# EAGLE design flight_computer_board_f1 (EAGLE 9.0.1)
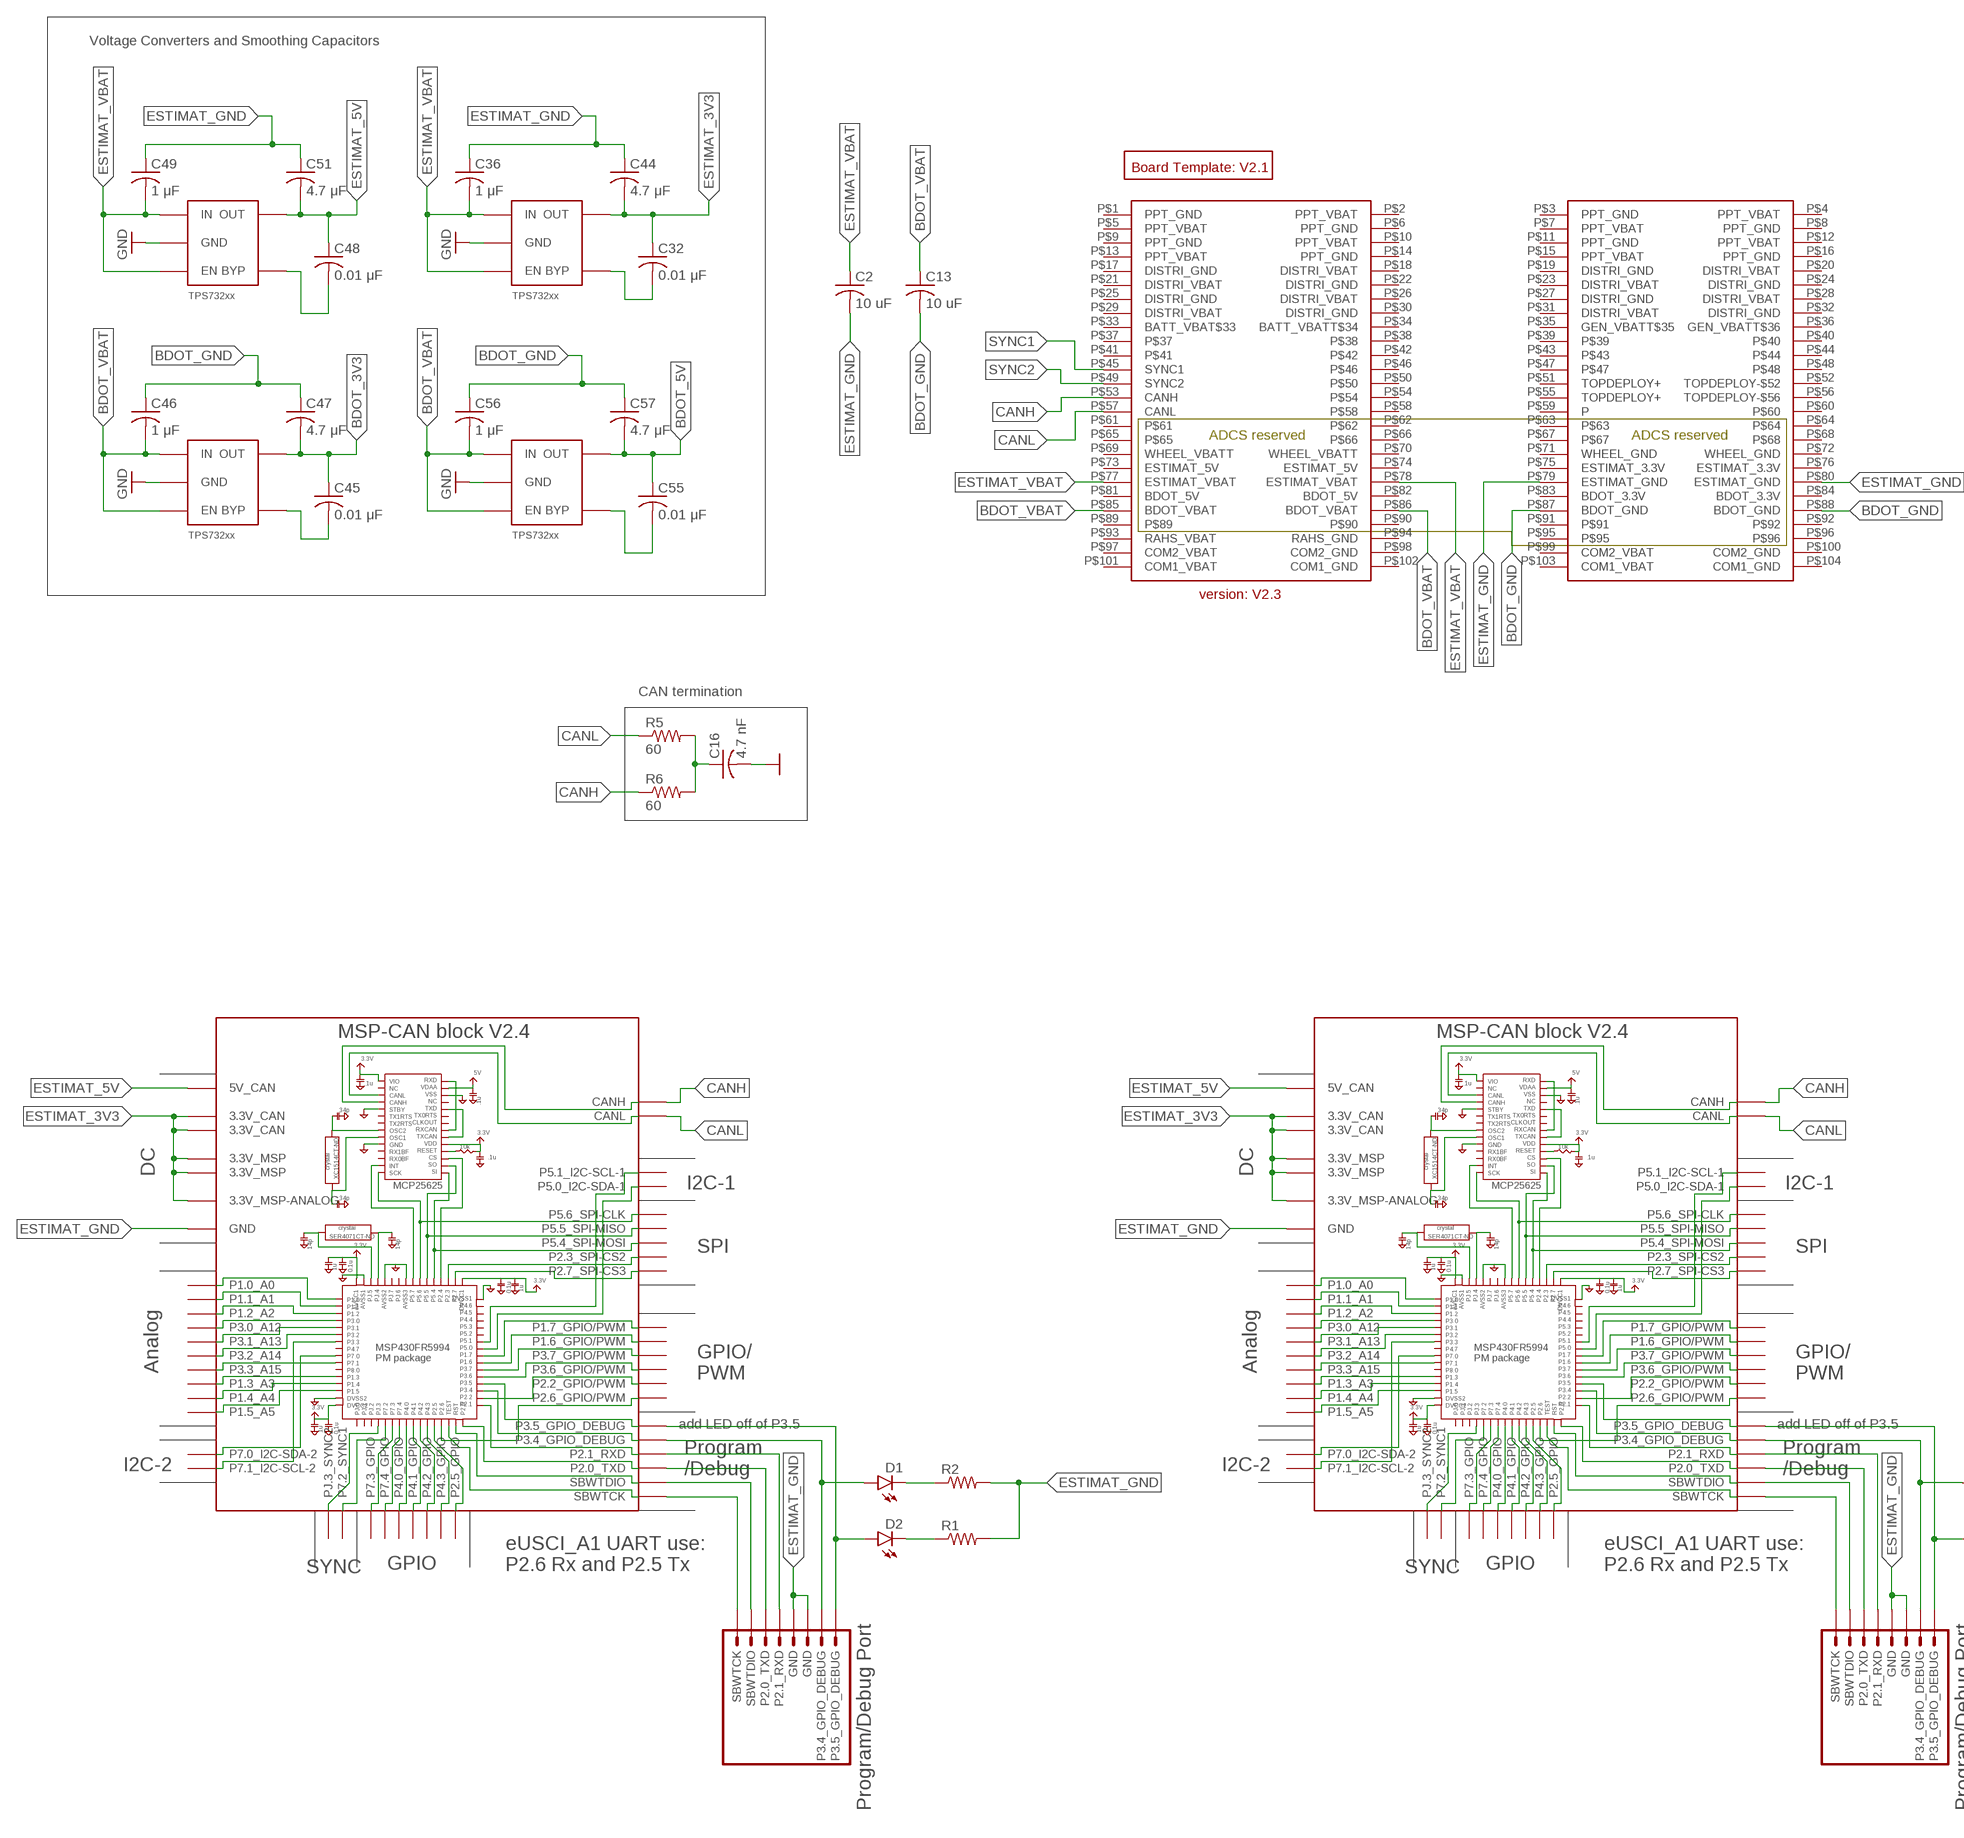
[diagram p0: schematic, sheet 1, part 1 of 2]
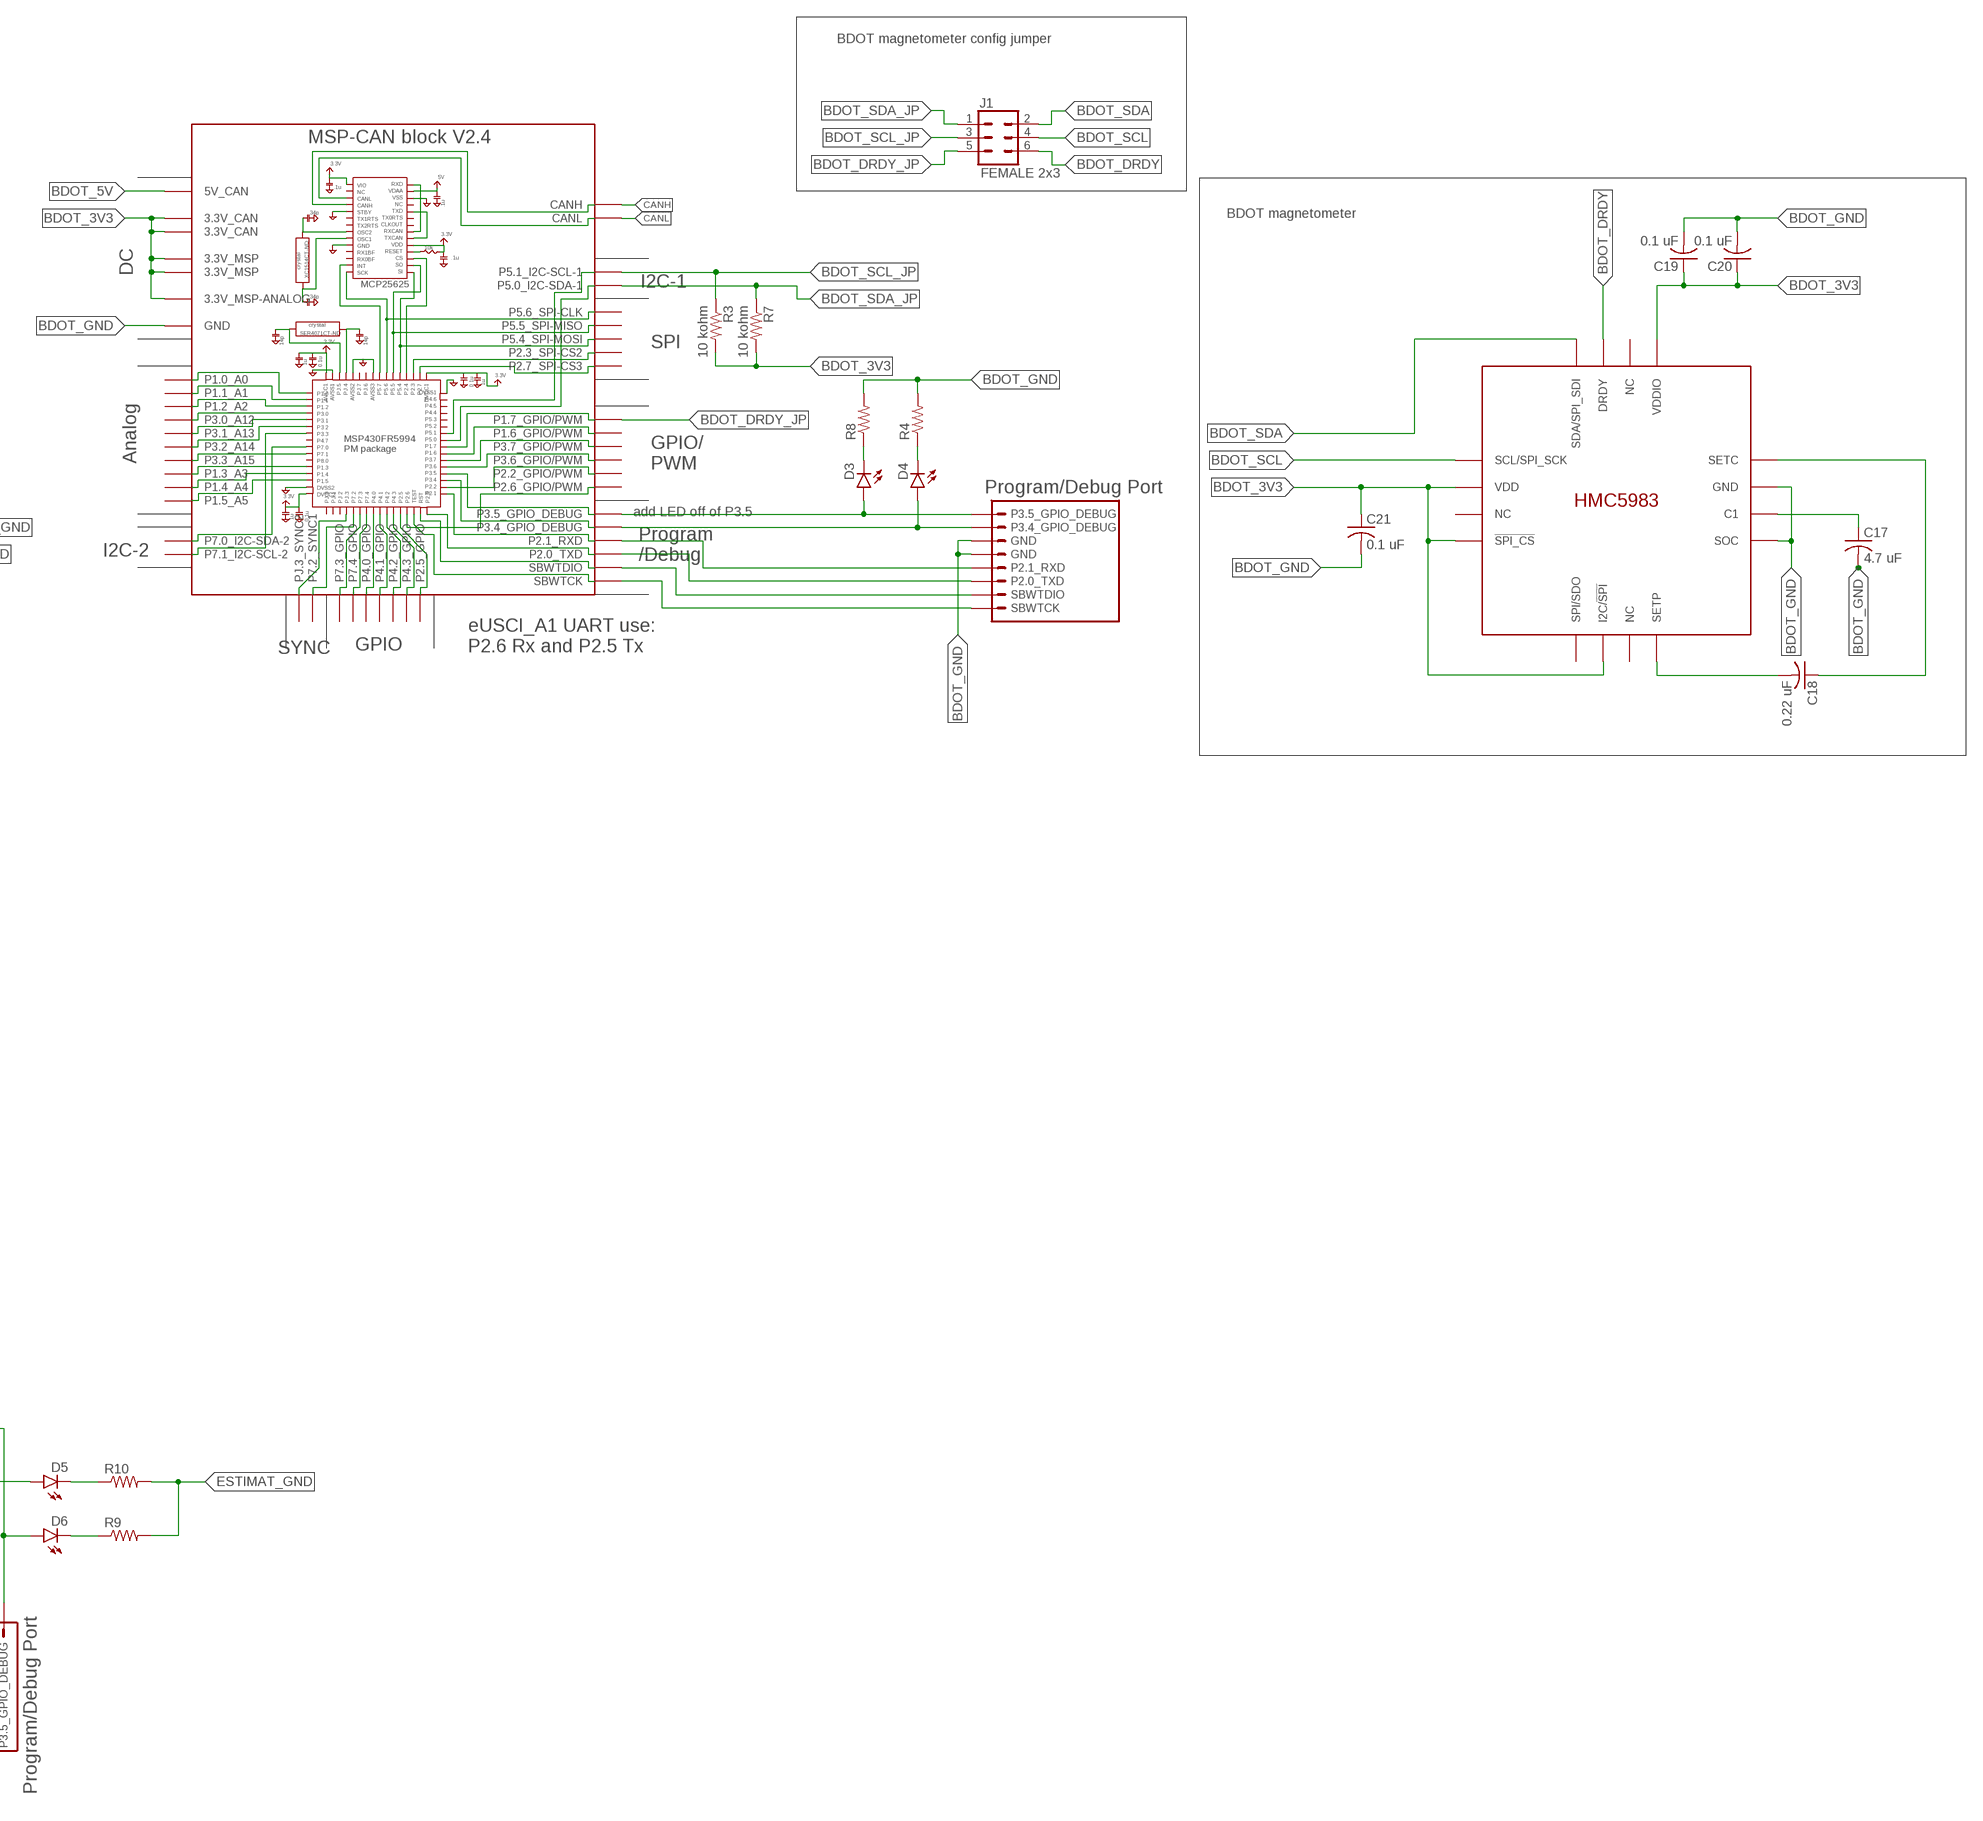
[diagram p1: schematic, sheet 1, part 2 of 2]

## Parts
BLK1  MSP-CAN_BLOCK  [MSP-CAN_BLOCK]
BLK2  MSP-CAN_BLOCK  [MSP-CAN_BLOCK]
C2  10 uF  C-USC0805  [C0805]
C13  10 uF  C-USC0805  [C0805]
C16  4.7 nF  C-USC0805  [C0805]
C17  4.7 uF  C-USC0805  [C0805]
C18  0.22 uF  C-USC0805  [C0805]
C19  0.1 uF  C-USC0805  [C0805]
C20  0.1 uF  C-USC0805  [C0805]
C21  0.1 uF  C-USC0805  [C0805]
C32  0.01 μF  C-USC0805  [C0805]
C36  1 μF  C-USC0805  [C0805]
C44  4.7 μF  C-USC0805  [C0805]
C45  0.01 μF  C-USC0805  [C0805]
C46  1 μF  C-USC0805  [C0805]
C47  4.7 μF  C-USC0805  [C0805]
C48  0.01 μF  C-USC0805  [C0805]
C49  1 μF  C-USC0805  [C0805]
C51  4.7 μF  C-USC0805  [C0805]
C55  0.01 μF  C-USC0805  [C0805]
C56  1 μF  C-USC0805  [C0805]
C57  4.7 μF  C-USC0805  [C0805]
D1  LED  [LED-1206]
D2  LED  [LED-1206]
D3  LED  [LED-1206]
D4  LED  [LED-1206]
D5  LED  [LED-1206]
D6  LED  [LED-1206]
J1  FEMALE 2x3  CONN_03X2FEMALE  [2X3]
R1  RESISTOR0805  [0805]
R2  RESISTOR0805  [0805]
R3  10 kohm  RESISTOR0805  [0805]
R4  RESISTOR0805  [0805]
R5  60  RESISTOR0805-RES  [0805]
R6  60  RESISTOR0805-RES  [0805]
R7  10 kohm  RESISTOR0805  [0805]
R8  RESISTOR0805  [0805]
R9  RESISTOR0805  [0805]
R10  RESISTOR0805  [0805]
U4  TPS732XX  [SOT-23-5]
U5  TPS732XX  [SOT-23-5]
U6  TPS732XX  [SOT-23-5]
U8  TPS732XX  [SOT-23-5]
U$1  PROGRAM/DEBUG_PORT  [1X08_CONNECTOR]
U$2  PROGRAM/DEBUG_PORT  [1X08_CONNECTOR]
U$5  BOARD_TEMPLATE1  [BOARD_TEMPLATE]
U$6  PC104_CONNECTOR  [PC104_CONNECTOR]
U$7  MSP-CAN_BLOCK  [MSP-CAN_BLOCK]
U$14  PROGRAM/DEBUG_PORT  [1X08_CONNECTOR]
U$15  HMC5983  [HMC5983]

## Nets
BDOT_3V3: C19.1 C20.1 C21.1 C45.1 C47.2 R3.2 R7.2 U5.P$5(OUT) U$7.3.3V@CAN1(3.3V_CAN) U$7.3.3V@CAN2(3.3V_CAN) U$7.3.3V@MSP1(3.3V_MSP) U$7.3.3V@MSP2(3.3V_MSP) U$7.3.3V_ANALOG@MSP2(3.3V_MSP-ANALOG) U$15.!SPI_CS U$15.I2C/!SPI U$15.VDD U$15.VDDIO
BDOT_5V: C55.1 C57.2 U8.P$5(OUT) U$7.5V(5V_CAN)
BDOT_DRDY: J1.6 U$15.DRDY
BDOT_DRDY_JP: J1.5 U$7.P1.7_GPIO/PWM
BDOT_GND: C13.2 C17.2 C19.2 C20.2 C21.2 C46.1 C47.1 C56.1 C57.1 R4.2 R8.2 U5.P$2(GND) U8.P$2(GND) U$6.P$87(BDOT_GND) U$6.P$88(BDOT_GND) U$7.GND@1(GND) U$7.GND@2(GND) U$7.GND@3(GND) U$7.GND@4(GND) U$7.GND@5(GND) U$7.GND@7(GND) U$7.GND@8(GND) U$7.GND@9(GND) U$7.GND@10(GND) U$7.GND@11(GND) U$7.GND@12(GND) U$7.GND@13(GND) U$7.GND@14(GND) U$7.GND@15(GND) U$7.GND@16(GND) U$7.GND@17(GND) U$7.GND@26(GND) U$14.5(GND) U$14.6(GND) U$15.GND U$15.SOC ; supply symbol labelled GND
BDOT_LDO_3V3_BYP: C45.2 U5.P$4(BYP)
BDOT_LDO_5V_BYP: C55.2 U8.P$4(BYP)
BDOT_P3.4_GPIO_DEBUG: D4.A U$7.P3.4_GPIO_DEBUG U$14.7(P3.4_GPIO_DEBUG)
BDOT_P3.5_GPIO_DEBUG: D3.A U$7.P3.5_GPIO_DEBUG U$14.8(P3.5_GPIO_DEBUG)
BDOT_RXD: U$7.P2.1_RXD U$14.4(P2.1_RXD)
BDOT_SBWTCK: U$7.SBWTCK U$14.SBWTCK
BDOT_SBWTDIO: U$7.SBWTDIO U$14.2(SBWTDIO)
BDOT_SCL: J1.4 U$15.SCL/SPI_SCK
BDOT_SCL_JP: J1.3 R3.1 U$7.P5.1_I2C-SCL-1
BDOT_SDA: J1.2 U$15.SDA/SPI_SDI
BDOT_SDA_JP: J1.1 R7.1 U$7.P5.0_I2C-SDA-1
BDOT_TXD: U$7.P2.0_TXD U$14.3(P2.0_TXD)
BDOT_VBAT: C13.1 C46.2 C56.2 U5.P$1(IN) U5.P$3(EN) U8.P$1(IN) U8.P$3(EN) U$6.P$85(BDOT_VBAT) U$6.P$86(BDOT_VBAT)
CANH: BLK1.CANH BLK2.CANH R6.1 U$6.P$53(CANH) U$7.CANH
CANL: BLK1.CANL BLK2.CANL R5.1 U$6.P$57(CANL) U$7.CANL
ESTIMAT_3V3: BLK1.3.3V@CAN1(3.3V_CAN) BLK1.3.3V@CAN2(3.3V_CAN) BLK1.3.3V@MSP1(3.3V_MSP) BLK1.3.3V@MSP2(3.3V_MSP) BLK1.3.3V_ANALOG@MSP2(3.3V_MSP-ANALOG) BLK2.3.3V@CAN1(3.3V_CAN) BLK2.3.3V@CAN2(3.3V_CAN) BLK2.3.3V@MSP1(3.3V_MSP) BLK2.3.3V@MSP2(3.3V_MSP) BLK2.3.3V_ANALOG@MSP2(3.3V_MSP-ANALOG) C32.1 C44.2 U4.P$5(OUT)
ESTIMAT_5V: BLK1.5V(5V_CAN) BLK2.5V(5V_CAN) C48.1 C51.2 U6.P$5(OUT)
ESTIMAT_GND: BLK1.GND@1(GND) BLK1.GND@2(GND) BLK1.GND@3(GND) BLK1.GND@4(GND) BLK1.GND@5(GND) BLK1.GND@7(GND) BLK1.GND@8(GND) BLK1.GND@9(GND) BLK1.GND@10(GND) BLK1.GND@11(GND) BLK1.GND@12(GND) BLK1.GND@13(GND) BLK1.GND@14(GND) BLK1.GND@15(GND) BLK1.GND@16(GND) BLK1.GND@17(GND) BLK1.GND@26(GND) BLK2.GND@1(GND) BLK2.GND@2(GND) BLK2.GND@3(GND) BLK2.GND@4(GND) BLK2.GND@5(GND) BLK2.GND@7(GND) BLK2.GND@8(GND) BLK2.GND@9(GND) BLK2.GND@10(GND) BLK2.GND@11(GND) BLK2.GND@12(GND) BLK2.GND@13(GND) BLK2.GND@14(GND) BLK2.GND@15(GND) BLK2.GND@16(GND) BLK2.GND@17(GND) BLK2.GND@26(GND) C2.2 C16.2 C36.1 C44.1 C49.1 C51.1 R1.2 R2.2 R9.2 R10.2 U4.P$2(GND) U6.P$2(GND) U$1.5(GND) U$1.6(GND) U$2.5(GND) U$2.6(GND) U$6.P$79(ESTIMAT_GND) U$6.P$80(ESTIMAT_GND) ; supply symbol labelled GND
ESTIMAT_LDO_3V3_BYP: C32.2 U4.P$4(BYP)
ESTIMAT_LDO_5V_BYP: C48.2 U6.P$4(BYP)
ESTIMAT_VBAT: C2.1 C36.2 C49.2 U4.P$1(IN) U4.P$3(EN) U6.P$1(IN) U6.P$3(EN) U$6.P$77(ESTIMAT_VBAT) U$6.P$78(ESTIMAT_VBAT)
N$1: D2.C R1.1
N$2: D1.C R2.1
N$3: D6.C R9.1
N$4: D5.C R10.1
N$16: D4.C R4.1
N$17: C16.1 R5.2 R6.2
N$18: D3.C R8.1
N$19: C17.1 U$15.C1
N$20: C18.2 U$15.SETP
N$21: C18.1 U$15.SETC
P3.4_GPIO_DEBUG: BLK1.P3.4_GPIO_DEBUG D1.A U$1.7(P3.4_GPIO_DEBUG)
P3.4_GPIO_DEBUG1: BLK2.P3.4_GPIO_DEBUG D5.A U$2.7(P3.4_GPIO_DEBUG)
P3.5_GPIO_DEBUG: BLK1.P3.5_GPIO_DEBUG D2.A U$1.8(P3.5_GPIO_DEBUG)
P3.5_GPIO_DEBUG1: BLK2.P3.5_GPIO_DEBUG D6.A U$2.8(P3.5_GPIO_DEBUG)
RXD: BLK1.P2.1_RXD U$1.4(P2.1_RXD)
RXD1: BLK2.P2.1_RXD U$2.4(P2.1_RXD)
SBWTCK: BLK1.SBWTCK U$1.SBWTCK
SBWTCK1: BLK2.SBWTCK U$2.SBWTCK
SBWTDIO: BLK1.SBWTDIO U$1.2(SBWTDIO)
SBWTDIO1: BLK2.SBWTDIO U$2.2(SBWTDIO)
SYNC1: U$6.P$45(SYNC1)
SYNC2: U$6.P$49(SYNC2)
TXD: BLK1.P2.0_TXD U$1.3(P2.0_TXD)
TXD1: BLK2.P2.0_TXD U$2.3(P2.0_TXD)
Unconnected: BLK1.P1.0_A0 BLK1.P1.1_A1 BLK1.P1.2_A2 BLK1.P1.3_A3 BLK1.P1.4_A4 BLK1.P1.5_A5 BLK1.P1.6_GPIO/PWM BLK1.P1.7_GPIO/PWM BLK1.P2.2_GPIO/PWM BLK1.P2.4_SPI-CS2(P2.3_SPI-CS2) BLK1.P2.5_GPIO BLK1.P2.6_GPIO/PWM BLK1.P2.7_SPI-CS3 BLK1.P3.0_A12 BLK1.P3.1_A13 BLK1.P3.2_A14 BLK1.P3.3_A15 BLK1.P3.6_GPIO/PWM BLK1.P3.7_GPIO/PWM BLK1.P4.0_GPIO BLK1.P4.1_GPIO BLK1.P4.2_GPIO BLK1.P4.3_GPIO BLK1.P5.0_I2C-SDA-1 BLK1.P5.1_I2C-SCL-1 BLK1.P5.4_SPI-MOSI BLK1.P5.5_SPI-MISO BLK1.P5.6_SPI-CLK BLK1.P7.0_I2C-SDA-2 BLK1.P7.1_I2C-SCL-2 BLK1.P7.2_SYNC1 BLK1.P7.3_GPIO BLK1.P7.4_GPIO BLK1.PJ.3_SYNC2 BLK2.P1.0_A0 BLK2.P1.1_A1 BLK2.P1.2_A2 BLK2.P1.3_A3 BLK2.P1.4_A4 BLK2.P1.5_A5 BLK2.P1.6_GPIO/PWM BLK2.P1.7_GPIO/PWM BLK2.P2.2_GPIO/PWM BLK2.P2.4_SPI-CS2(P2.3_SPI-CS2) BLK2.P2.5_GPIO BLK2.P2.6_GPIO/PWM BLK2.P2.7_SPI-CS3 BLK2.P3.0_A12 BLK2.P3.1_A13 BLK2.P3.2_A14 BLK2.P3.3_A15 BLK2.P3.6_GPIO/PWM BLK2.P3.7_GPIO/PWM BLK2.P4.0_GPIO BLK2.P4.1_GPIO BLK2.P4.2_GPIO BLK2.P4.3_GPIO BLK2.P5.0_I2C-SDA-1 BLK2.P5.1_I2C-SCL-1 BLK2.P5.4_SPI-MOSI BLK2.P5.5_SPI-MISO BLK2.P5.6_SPI-CLK BLK2.P7.0_I2C-SDA-2 BLK2.P7.1_I2C-SCL-2 BLK2.P7.2_SYNC1 BLK2.P7.3_GPIO BLK2.P7.4_GPIO BLK2.PJ.3_SYNC2 U$6.P$1(PPT_GND) U$6.P$2(PPT_VBAT) U$6.P$3(PPT_GND) U$6.P$4(PPT_VBAT) U$6.P$5(PPT_VBAT) U$6.P$6(PPT_GND) U$6.P$7(PPT_VBAT) U$6.P$8(PPT_GND) U$6.P$9(PPT_GND) U$6.P$10(PPT_VBAT) U$6.P$11(PPT_GND) U$6.P$12(PPT_VBAT) U$6.P$13(PPT_VBAT) U$6.P$14(PPT_GND) U$6.P$15(PPT_VBAT) U$6.P$16(PPT_GND) U$6.P$17(DISTRI_GND) U$6.P$18(DISTRI_VBAT) U$6.P$19(DISTRI_GND) U$6.P$20(DISTRI_VBAT) U$6.P$21(DISTRI_VBAT) U$6.P$22(DISTRI_GND) U$6.P$23(DISTRI_VBAT) U$6.P$24(DISTRI_GND) U$6.P$25(DISTRI_GND) U$6.P$26(DISTRI_VBAT) U$6.P$27(DISTRI_GND) U$6.P$28(DISTRI_VBAT) U$6.P$29(DISTRI_VBAT) U$6.P$30(DISTRI_GND) U$6.P$31(DISTRI_VBAT) U$6.P$32(DISTRI_GND) U$6.P$33(BATT_VBAT$33) U$6.P$34(BATT_VBATT$34) U$6.P$35(GEN_VBATT$35) U$6.P$36(GEN_VBATT$36) U$6.P$37 U$6.P$38 U$6.P$39 U$6.P$40 U$6.P$41 U$6.P$42 U$6.P$43 U$6.P$44 U$6.P$46 U$6.P$47 U$6.P$48 U$6.P$50 U$6.P$51(TOPDEPLOY+) U$6.P$52(TOPDEPLOY-$52) U$6.P$54 U$6.P$55(TOPDEPLOY+) U$6.P$56(TOPDEPLOY-$56) U$6.P$58 U$6.P$59(P) U$6.P$60 U$6.P$61 U$6.P$62 U$6.P$63 U$6.P$64 U$6.P$65 U$6.P$66 U$6.P$67 U$6.P$68 U$6.P$69(WHEEL_VBATT) U$6.P$70(WHEEL_VBATT) U$6.P$71(WHEEL_GND) U$6.P$72(WHEEL_GND) U$6.P$73(ESTIMAT_5V) U$6.P$74(ESTIMAT_5V) U$6.P$75(ESTIMAT_3.3V) U$6.P$76(ESTIMAT_3.3V) U$6.P$81(BDOT_5V) U$6.P$82(BDOT_5V) U$6.P$83(BDOT_3.3V) U$6.P$84(BDOT_3.3V) U$6.P$89 U$6.P$90 U$6.P$91 U$6.P$92 U$6.P$93(RAHS_VBAT) U$6.P$94(RAHS_GND) U$6.P$95 U$6.P$96 U$6.P$97(COM2_VBAT) U$6.P$98(COM2_GND) U$6.P$99(COM2_VBAT) U$6.P$100(COM2_GND) U$6.P$101(COM1_VBAT) U$6.P$102(COM1_GND) U$6.P$103(COM1_VBAT) U$6.P$104(COM1_GND) U$7.P1.0_A0 U$7.P1.1_A1 U$7.P1.2_A2 U$7.P1.3_A3 U$7.P1.4_A4 U$7.P1.5_A5 U$7.P1.6_GPIO/PWM U$7.P2.2_GPIO/PWM U$7.P2.4_SPI-CS2(P2.3_SPI-CS2) U$7.P2.5_GPIO U$7.P2.6_GPIO/PWM U$7.P2.7_SPI-CS3 U$7.P3.0_A12 U$7.P3.1_A13 U$7.P3.2_A14 U$7.P3.3_A15 U$7.P3.6_GPIO/PWM U$7.P3.7_GPIO/PWM U$7.P4.0_GPIO U$7.P4.1_GPIO U$7.P4.2_GPIO U$7.P4.3_GPIO U$7.P5.4_SPI-MOSI U$7.P5.5_SPI-MISO U$7.P5.6_SPI-CLK U$7.P7.0_I2C-SDA-2 U$7.P7.1_I2C-SCL-2 U$7.P7.2_SYNC1 U$7.P7.3_GPIO U$7.P7.4_GPIO U$7.PJ.3_SYNC2 U$15.NC@1(NC) U$15.NC@2(NC) U$15.NC@3(NC) U$15.SPI_SDO(SPI/SDO)

## Notes on the sheet
- BDOT magnetometer config jumper
- Voltage Converters and Smoothing Capacitors
- BDOT magnetometer
- CAN termination

## Library data of the parts
BLK1 BLK2 U$7 = DubSat1 Components:MSP-CAN_BLOCK
C2 C13 C16-C21 C32 C36 C44-C49 C51 C55-C57 = rcl:C-US: CAPACITOR, American symbol
D1-D6 = DubSat1 Components:LED
J1 = SparkFun-Connectors:CONN_03X2: Multi connection point. Often used as Generic Header-pin footprint for 0.1 inch spaced/style header connections You can populate with any combo of single row headers, but if you'd like an exact match, check these: Header - 2x3 (Male, 0.1") <https://www.sparkfun.com/products/12807> (PRT-12807) Header - 2x3 (Female, 0.1") <https://www.sparkfun.com/products/13010> (PRT-13010) 2x3 Pin Shrouded Header <https://www.sparkfun.com/products/10877> (PRT-10877) On any of the 0.1 inch spaced packages, you can populate with these: Break Away Headers - Straight <https://www.sparkfun.com/products/116> (PRT-00116) Break Away Male Headers - Right Angle <https://www.sparkfun.com/products/553> (PRT-00553) Female Headers <https://www.sparkfun.com/products/115> (PRT-00115) Break Away Headers - Machine Pin <https://www.sparkfun.com/products/117> (PRT-00117) Break Away Female Headers - Swiss Machine Pin <https://www.sparkfun.com/products/743> (PRT-00743) Special note: the shrouded connector mates well with our 3x2 ribbon cables: Ribbon Crimp Connector - 6-pin (2x3, Female) <https://www.sparkfun.com/products/10651> (PRT-10651) Ribbon Cable - 6 wire (15ft) <https://www.sparkfun.com/products/10646> (PRT-10646); PROD_ID: CONN-11566
R1-R4 R7-R10 = DubSat1 Components:RESISTOR: Resistor Basic schematic elements and footprints for 0603, 1206, and PTH resistors.
R5 R6 = SparkFun-Resistors:RESISTOR: Resistor Basic schematic elements and footprints for 0603, 1206, and PTH resistors.
U4-U6 U8 = DubSat1 Components:TPS732XX
U$1 U$2 U$14 = DubSat1 Components:PROGRAM/DEBUG_PORT
U$5 = DubSat1 Components:BOARD_TEMPLATE
U$6 = DubSat1 Components:PC104_CONNECTOR
U$15 = DubSat1 Components:HMC5983

## Net classes
0 default: width 0.254 mm, drill 0.254 mm, clearance 0.152 mm

## Board
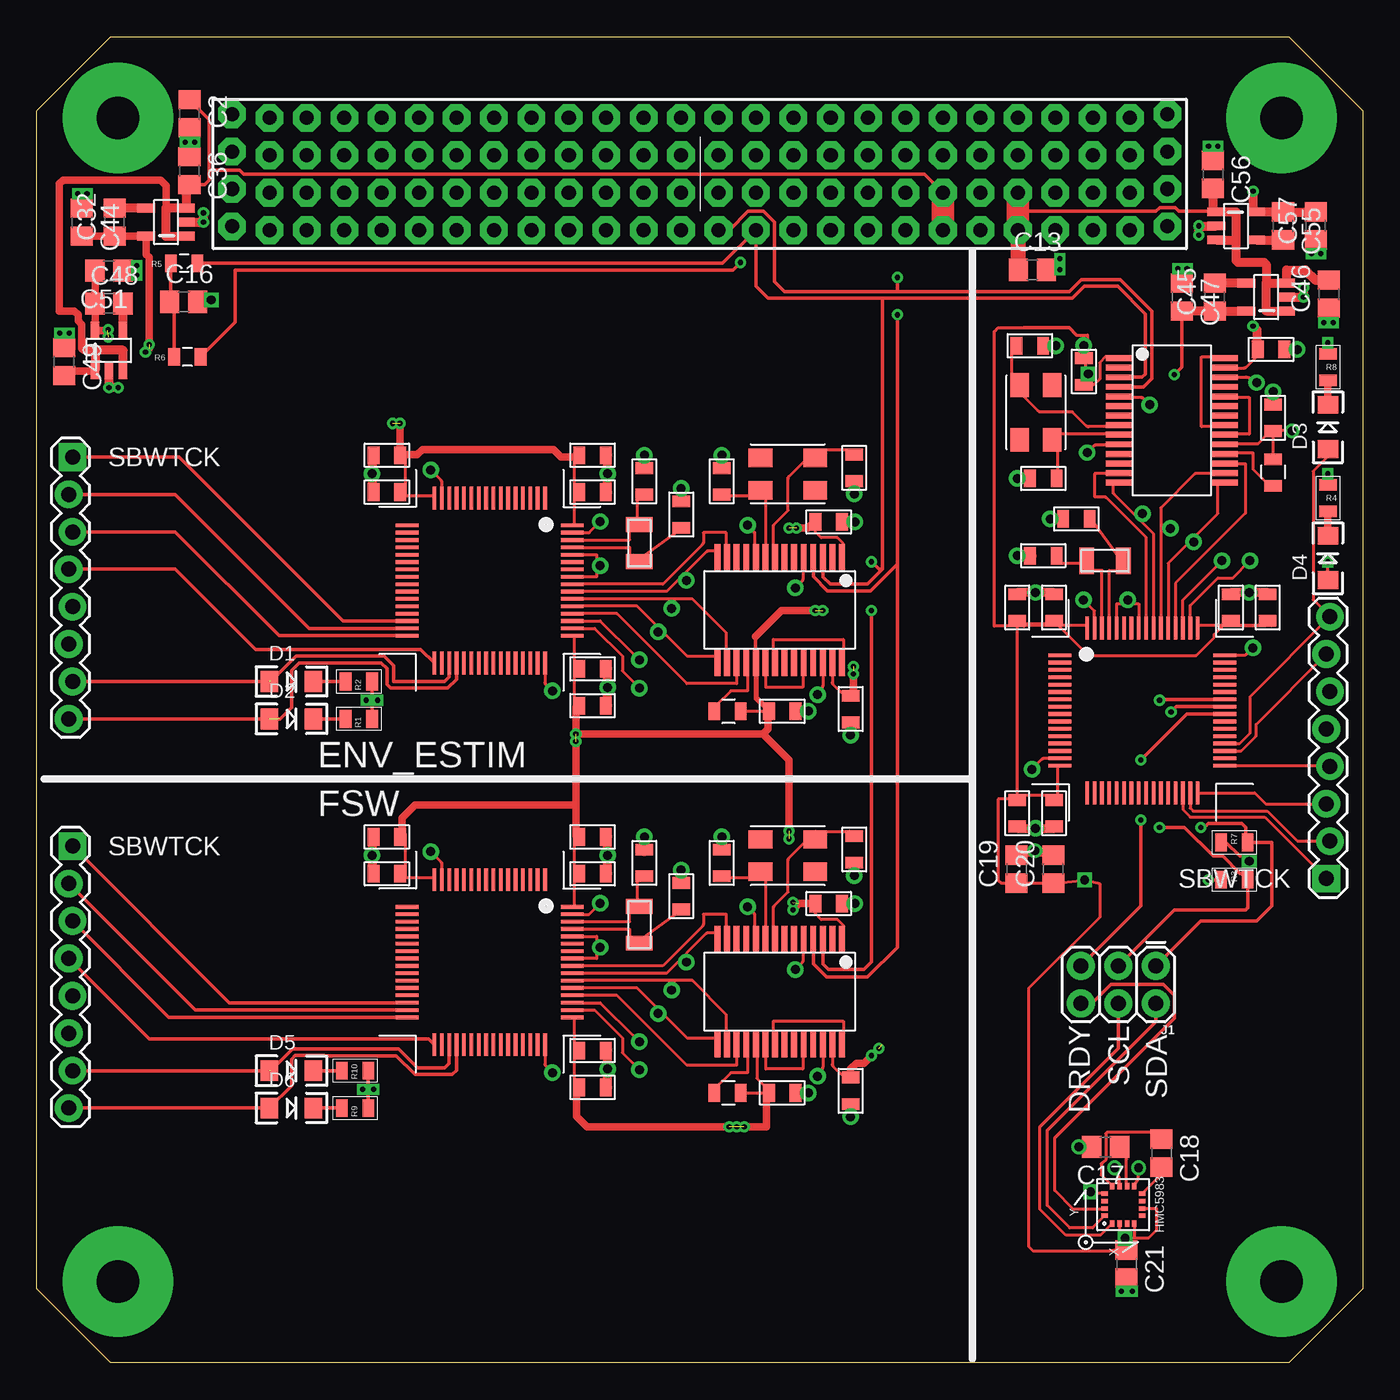
[diagram p2: board, top side]
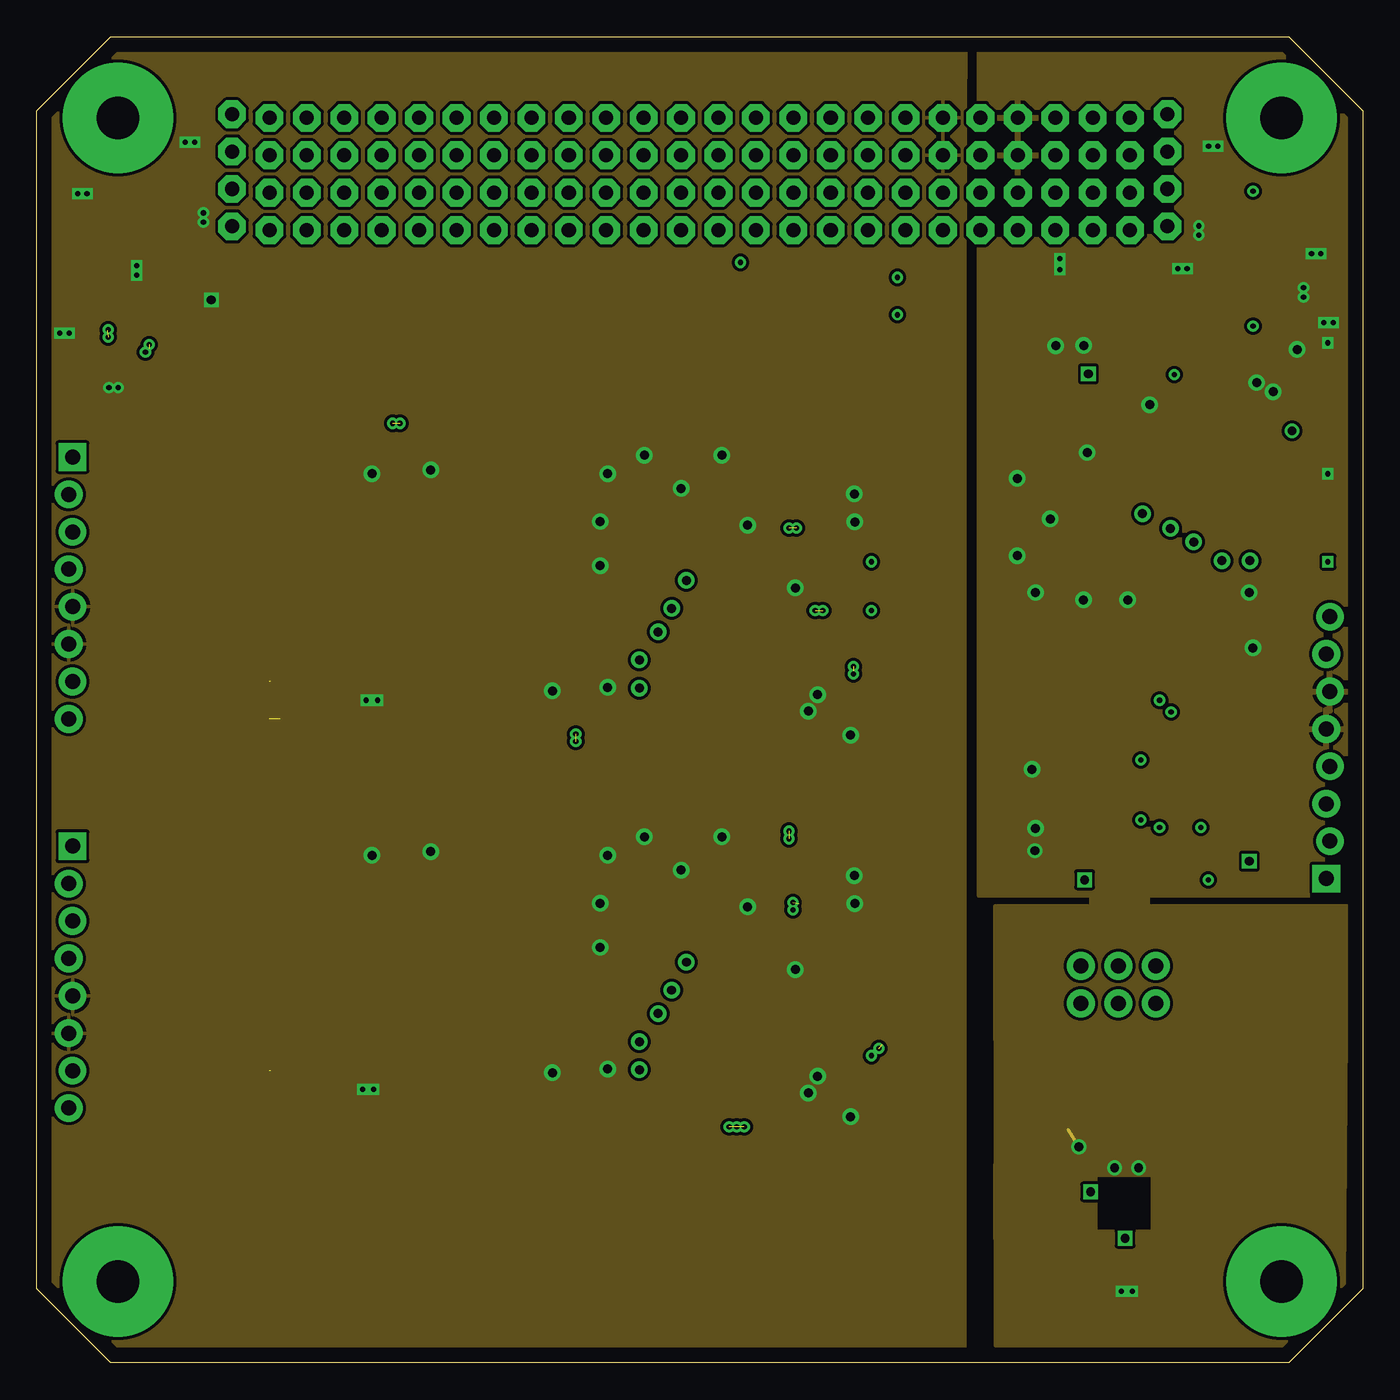
[diagram p3: board, inner layer GND]
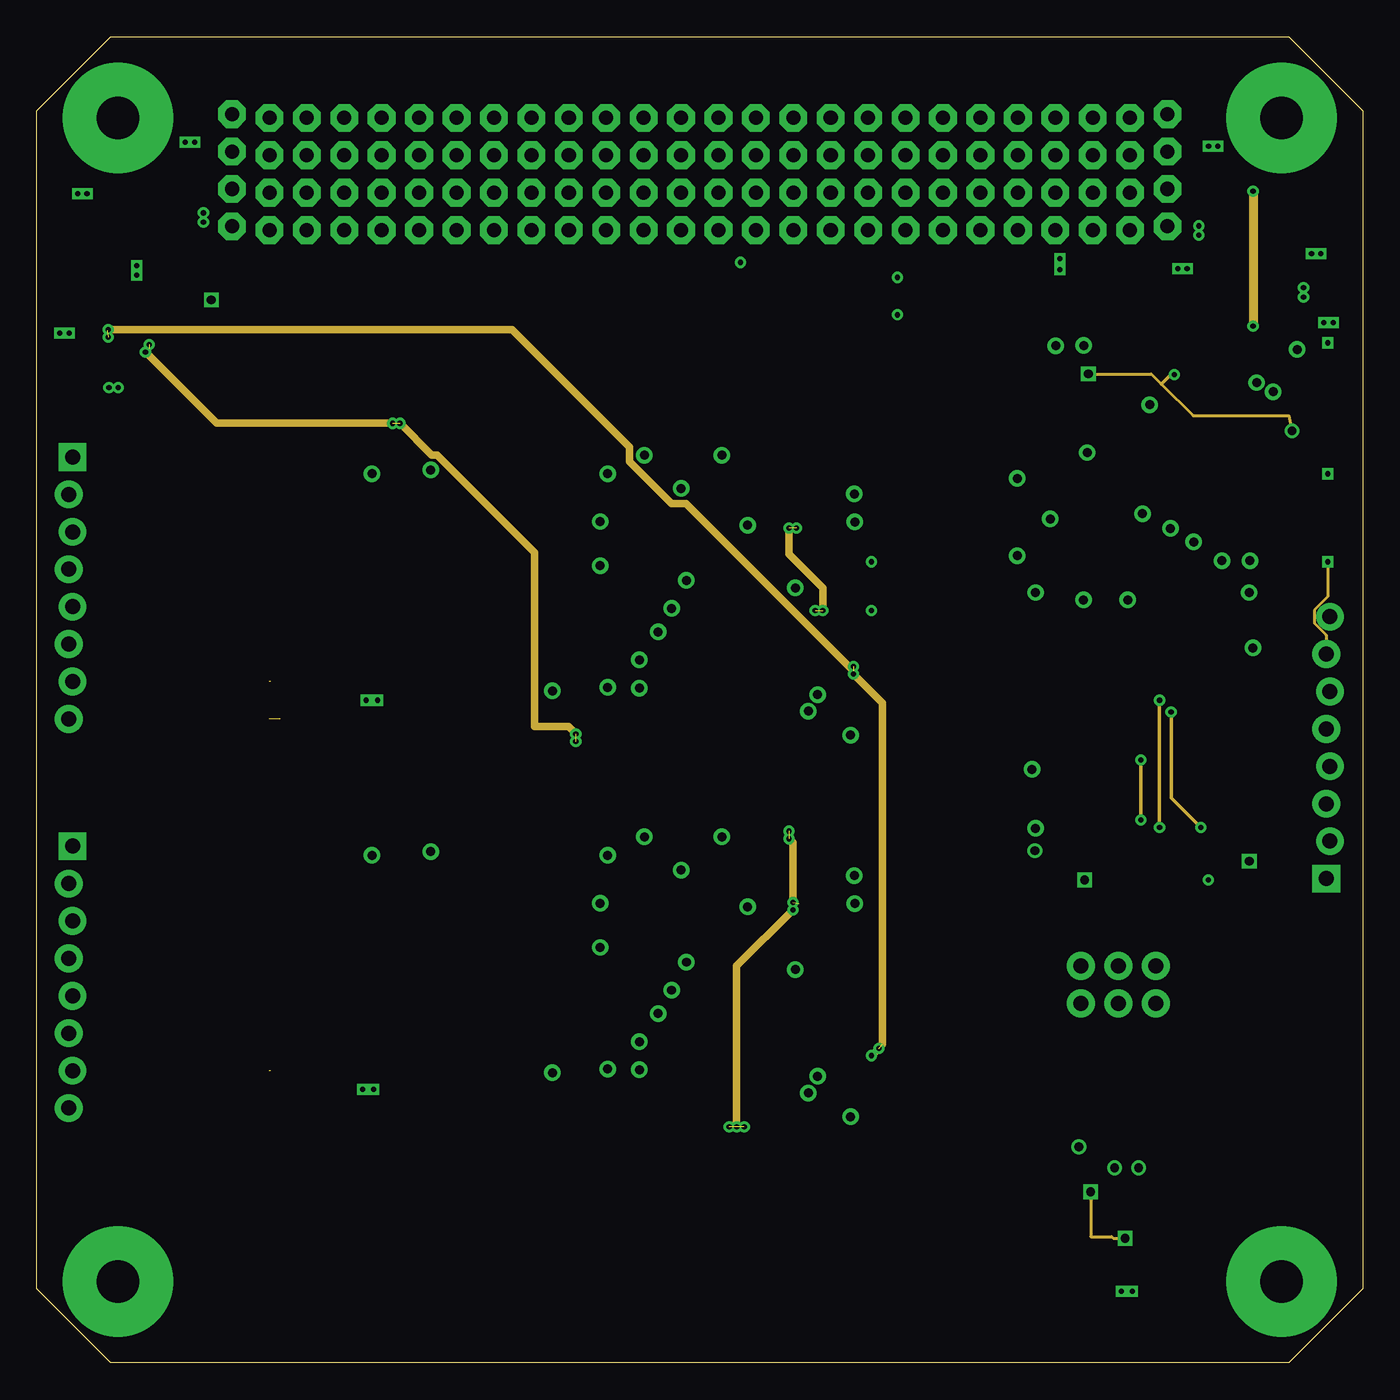
[diagram p4: board, inner layer Route3]
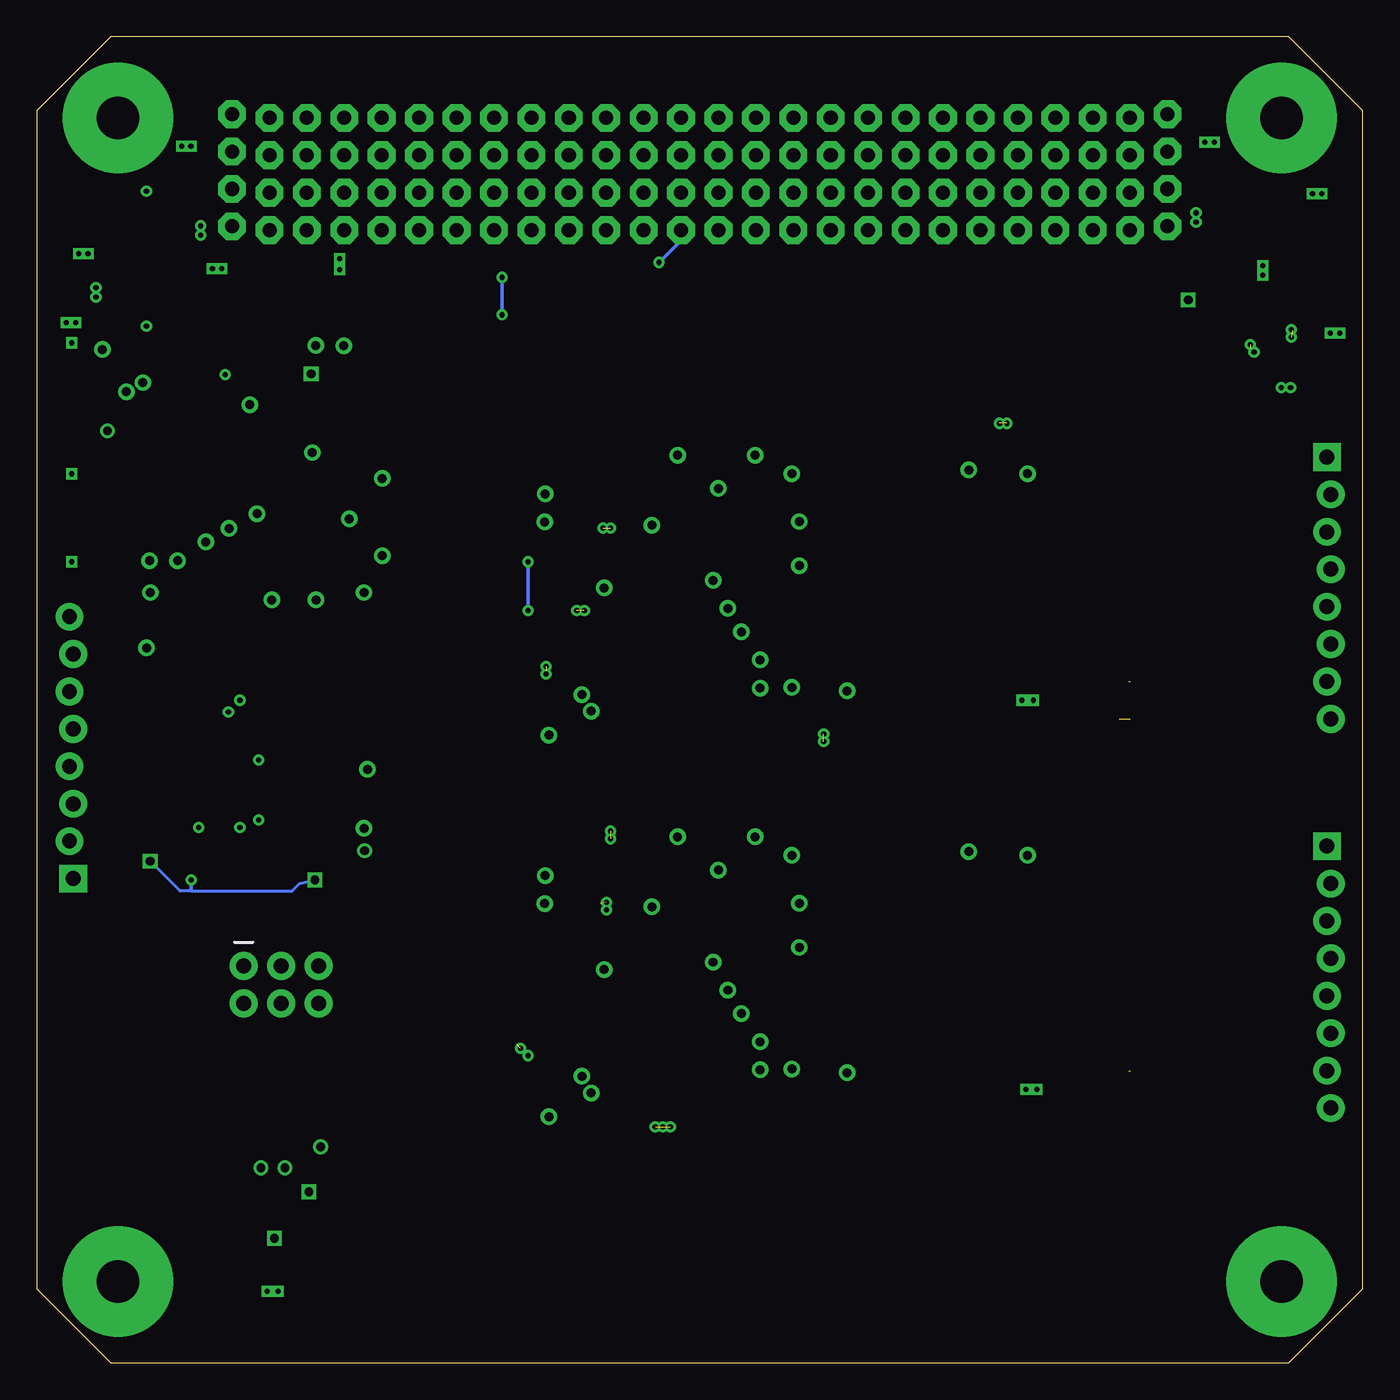
[diagram p5: board, bottom side, seen from below]

Size 90 x 90 mm. Coordinates in mm from the lower left corner, seen from the top.
Copper layers (1*2*3*16): Top 0.035mm / dielectric 1.5mm / GND 0.035mm / dielectric 0.15mm / Route3 0.035mm / dielectric 0.2mm / Bottom 0.035mm
Design rules "default *": minimum track width 10mil, minimum drill 24mil, track to track 8mil, track to pad 8mil, pad to pad 8mil, via to via 8mil, smd to smd 0mil, copper to edge 40mil, drill to drill 8mil, minimum pad ring 10mil, minimum via ring 8mil, stop-mask expansion 4mil, vias tented up to drill 0mil, thermal gap 10mil

### Footprints (pad centres in the part's own frame; a part is rotated, then mirrored left to right if it is on the bottom)
MSP-CAN_BLOCK = smd 1.2 x 0.8: 1 -6,6.08; 2 -6,7.88; 3 -8.5,6.08; 4 -8.5,7.88; 9 -8.5,-6.08; 10 -8.5,-7.88; 11 -6,-6.08; 12 -6,-7.88; 13 8.5,6.08; 14 8.5,7.88; 15 6,6.08; 16 6,7.88; 23 8.875,18.955; 24 8.875,20.755; 25 8.875,17.045; 26 8.875,15.245; 27 -3.975,22.105; 28 -3.975,23.905 | smd 1 x 0.25: 3.3V@CAN1 -3.975,22.025; 3.3V@CAN2 8.875,18.875; 3.3V@MSP1 8.501,5.884; 3.3V@MSP2 -8.533,-5.962; 3.3V_ANALOG@MSP2 -8.482,5.904 | smd 0.8 x 1.2: 5 -5.83,10.5; 6 -7.63,10.5; 7 -3.58,13; 8 -5.38,13; 17 -8.545,24.75; 18 -6.745,24.75; 19 -5.83,15.75; 20 -7.63,15.75; 21 7.83,24.5; 22 9.63,24.5 | smd 0.25 x 1: 5V 7.65,24.5 | smd 1.75 x 0.4: CANH -1.6,21.96; CANL -1.6,22.61; P$65 -1.6,23.91; P$66 -1.6,23.26; P$69 -1.6,21.31; P$70 -1.6,20.66; P$71 -1.6,20.01; P$72 -1.6,19.36; P$73 -1.6,18.71; P$74 -1.6,18.06; P$75 -1.6,17.41; P$76 -1.6,16.76; P$77 -1.6,16.11; P$78 -1.6,15.46; P$79 5.6,15.46; P$80 5.6,16.11; P$81 5.6,16.76; P$82 5.6,17.41; P$83 5.6,18.06; P$84 5.6,18.71; P$85 5.6,19.36; P$86 5.6,20.01; P$87 5.6,20.66; P$88 5.6,21.31; P$89 5.6,21.96; P$90 5.6,22.61; P$91 5.6,23.26; P$92 5.6,23.91 | drill 0.61: GND@1 -3.975,24.775; GND@2 -5.875,24.75; GND@3 -3.75,17.5; GND@4 0.5,20.75; GND@5 -8.5,15.75; GND@7 -8.5,10.5; GND@8 -7.25,8; GND@9 -4,7.5; GND@10 -1,7.5; GND@11 7.75,22.25; GND@12 10.5,24.5; GND@13 8.875,21.625; GND@14 7.25,8; GND@15 7.5,4.25; GND@16 -7.5,-4; GND@17 -7.25,-8; GND@26 -6.25,13; P2.4_SPI-CS2 5.397,10.16; P2.7_SPI-CS3 7.303,10.16; P5.4_SPI-MOSI 3.487,11.434; P5.5_SPI-MISO 1.9,12.354; P5.6_SPI-CLK 0,13.348 | smd 1.55 x 0.25: P1.0_A0 -5.6,3.75; P1.1_A1 -5.6,3.25; P1.2_A2 -5.6,2.75; P1.3_A3 -5.6,-1.75; P1.4_A4 -5.6,-2.25; P1.5_A5 -5.6,-2.75; P1.6_GPIO/PWM 5.6,-0.75; P1.7_GPIO/PWM 5.6,-0.25; P2.1_RXD 5.6,-3.75; P2.2_GPIO/PWM 5.6,-3.25; P3.0_A12 -5.6,2.25; P3.1_A13 -5.6,1.75; P3.2_A14 -5.6,1.25; P3.3_A15 -5.6,0.75; P3.4_GPIO_DEBUG 5.6,-2.75; P3.5_GPIO_DEBUG 5.6,-2.25; P3.6_GPIO/PWM 5.6,-1.75; P3.7_GPIO/PWM 5.6,-1.25; P5.0_I2C-SDA-1 5.6,0.25; P5.1_I2C-SCL-1 5.6,0.75; P7.0_I2C-SDA-2 -5.6,-0.25; P7.1_I2C-SCL-2 -5.6,-0.75; P$8 -5.6,0.25; P$11 -5.6,-1.25; P$15 -5.6,-3.25; P$16 -5.6,-3.75; P$43 5.6,1.25; P$44 5.6,1.75; P$45 5.6,2.25; P$46 5.6,2.75; P$47 5.6,3.25; P$48 5.6,3.75 | smd 0.25 x 1.55: P2.0_TXD 3.75,-5.6; P2.5_GPIO 1.75,-5.6; P2.6_GPIO/PWM 2.25,-5.6; P4.0_GPIO -0.25,-5.6; P4.1_GPIO 0.25,-5.6; P4.2_GPIO 0.75,-5.6; P4.3_GPIO 1.25,-5.6; P7.2_SYNC1 -1.75,-5.6; P7.3_GPIO -1.25,-5.6; P7.4_GPIO -0.75,-5.6; P$17 -3.75,-5.6; P$18 -3.25,-5.6; P$19 -2.75,-5.6; P$49 3.75,5.6; P$50 3.25,5.6; P$51 2.75,5.6; P$52 2.25,5.6; P$53 1.75,5.6; P$54 1.25,5.6; P$55 0.75,5.6; P$56 0.25,5.6; P$57 -0.25,5.6; P$58 -0.75,5.6; P$59 -1.25,5.6; P$60 -1.75,5.6; P$61 -2.25,5.6; P$62 -2.75,5.6; P$63 -3.25,5.6; P$64 -3.75,5.6; PJ.3_SYNC2 -2.25,-5.6; SBWTCK 2.75,-5.6; SBWTDIO 3.25,-5.6 | smd 1 x 1.8: P$93 -3.79,10.16; P$94 -1.29,10.16 | smd 1.25 x 1.6: P$104 -6.13,18.38; P$105 -6.13,22.08; P$106 -8.33,22.08; P$107 -8.33,18.38
C0805 = smd 1.3 x 1.5: 1 -0.95,0; 2 0.95,0
LED-1206 = smd 1.2 x 1.4: A -1.5,0; C 1.5,0
2X3 = drill 1.016 pad 1.88: 1 0,0; 2 0,2.54; 3 2.54,0; 4 2.54,2.54; 5 5.08,0; 6 5.08,2.54
0805 = smd 0.8 x 1.2: 1 -0.9,0; 2 0.9,0
SOT-23-5 = smd 0.6 x 1.2: P$1 -0.95,-1.35; P$2 0,-1.35; P$3 0.95,-1.35; P$4 0.95,1.35; P$5 -0.95,1.35
1X08_CONNECTOR = drill 1.016 pad 1.88: 2 2.54,-0.127; 3 5.08,0.127; 4 7.62,-0.127; 5 10.16,0.127; 6 12.7,-0.127; 7 15.24,0.127; 8 17.78,-0.127 | drill 1.016 pad 1.88 square: SBWTCK 0,0.127
BOARD_TEMPLATE = drill 2.9 pad 7.5: P$1 -39.5,39.5; P$2 -39.5,-39.5; P$3 39.5,-39.5; P$4 39.5,39.5
PC104_CONNECTOR = drill 0.953 pad 1.88 octagon: P$1 -31.75,32.134; P$2 -31.75,34.674; P$3 -31.75,37.214; P$4 -31.75,39.754; P$5 -29.21,31.88; P$6 -29.21,34.42; P$7 -29.21,36.96; P$8 -29.21,39.5; P$9 -26.67,31.88; P$10 -26.67,34.42; P$11 -26.67,36.96; P$12 -26.67,39.5; P$13 -24.13,31.88; P$14 -24.13,34.42; P$15 -24.13,36.96; P$16 -24.13,39.5; P$17 -21.59,31.88; P$18 -21.59,34.42; P$19 -21.59,36.96; P$20 -21.59,39.5; P$21 -19.05,31.88; P$22 -19.05,34.42; P$23 -19.05,36.96; P$24 -19.05,39.5; P$25 -16.51,31.88; P$26 -16.51,34.42; P$27 -16.51,36.96; P$28 -16.51,39.5; P$29 -13.97,31.88; P$30 -13.97,34.42; P$31 -13.97,36.96; P$32 -13.97,39.5; P$33 -11.43,31.88; P$34 -11.43,34.42; P$35 -11.43,36.96; P$36 -11.43,39.5; P$37 -8.89,31.88; P$38 -8.89,34.42; P$39 -8.89,36.96; P$40 -8.89,39.5; P$41 -6.35,31.88; P$42 -6.35,34.42; P$43 -6.35,36.96; P$44 -6.35,39.5; P$45 -3.81,31.88; P$46 -3.81,34.42; P$47 -3.81,36.96; P$48 -3.81,39.5; P$49 -1.27,31.88; P$50 -1.27,34.42; P$51 -1.27,36.96; P$52 -1.27,39.5; P$53 1.27,31.88; P$54 1.27,34.42; P$55 1.27,36.96; P$56 1.27,39.5; P$57 3.81,31.88; P$58 3.81,34.42; P$59 3.81,36.96; P$60 3.81,39.5; P$61 6.35,31.88; P$62 6.35,34.42; P$63 6.35,36.96; P$64 6.35,39.5; P$65 8.89,31.88; P$66 8.89,34.42; P$67 8.89,36.96; P$68 8.89,39.5; P$69 11.43,31.88; P$70 11.43,34.42; P$71 11.43,36.96; P$72 11.43,39.5; P$73 13.97,31.88; P$74 13.97,34.42; P$75 13.97,36.96; P$76 13.97,39.5; P$77 16.51,31.88; P$78 16.51,34.42; P$79 16.51,36.96; P$80 16.51,39.5; P$81 19.05,31.88; P$82 19.05,34.42; P$83 19.05,36.96; P$84 19.05,39.5; P$85 21.59,31.88; P$86 21.59,34.42; P$87 21.59,36.96; P$88 21.59,39.5; P$89 24.13,31.88; P$90 24.13,34.42; P$91 24.13,36.96; P$92 24.13,39.5; P$93 26.67,31.88; P$94 26.67,34.42; P$95 26.67,36.96; P$96 26.67,39.5; P$97 29.21,31.88; P$98 29.21,34.42; P$99 29.21,36.96; P$100 29.21,39.5; P$101 31.75,32.134; P$102 31.75,34.674; P$103 31.75,37.214; P$104 31.75,39.754
HMC5983 = smd 0.45 x 0.3: !SPI_CS -1.275,-0.75; C1 1.275,-0.25; GND 1.275,0.25; NC@3 -1.275,-0.25; SCL/SPI_SCK -1.275,0.75; SETC 1.275,0.75; SOC 1.275,-0.75; VDD -1.275,0.25 | smd 0.3 x 0.45: DRDY -0.25,1.275; I2C/!SPI -0.25,-1.275; NC@1 0.25,1.275; NC@2 0.25,-1.275; SDA/SPI_SDI -0.75,1.275; SETP 0.75,-1.275; SPI_SDO -0.75,-1.275; VDDIO 0.75,1.275

### Placement (x,y rotation side)
BLK1  30.74,53.1 270 top
BLK2  30.74,27.19 270 top
C2  10.37,84.77 270 top
C13  67.57,74.18 0 top
C16  9.98,72.01 0 top
C17  72.55,14.64 180 top
C18  76.34,14.23 270 top
C19  66.5,33.5 90 top
C20  69,33.5 90 top
C21  73.97,6.7 270 top
C32  5.28,77.42 90 top
C36  10.36,80.91 270 top
C44  3.06,77.42 270 top
C45  79.96,72.34 90 top
C46  87.7,72.53 90 top
C47  77.73,72.34 270 top
C48  4.9,71.89 0 top
C49  1.85,67.95 270 top
C51  4.9,74.11 180 top
C55  84.59,77.16 270 top
C56  79.83,80.66 270 top
C57  86.81,77.16 90 top
D1  17.28,46.24 0 top
D2  17.28,43.7 0 top
D3  87.64,63.51 90 top
D4  87.64,54.62 90 top
D5  17.28,19.82 0 top
D6  17.28,17.28 0 top
J1  75.96,26.93 180 top
R1  21.85,43.7 0 top
R2  21.85,46.24 0 top
R3  81.29,32.78 180 top
R4  87.64,58.68 90 top
R5  10,74.63 180 top
R6  10.22,68.28 180 top
R7  81.29,35.32 180 top
R8  87.64,67.57 90 top
R9  21.6,17.28 0 top
R10  21.6,19.82 0 top
U4  8.77,77.42 90 top
U5  83.45,72.34 90 top
U6  4.9,68.72 0 top
U8  81.42,77.16 270 top
U$1  2.3,61.48 270 top
U$2  2.3,35.06 270 top
U$5  45,45 0 top
U$6  45,45 0 top
U$7  75.05,44.28 0 top
U$14  87.66,32.86 90 top
U$15  73.75,10.72 90 top

### Tracks (layer width: path | path; a pad name or v marks a point on that pad's centre or on a via)
BDOT_3V3  (via drill 0.35, 0.6)
  Top 0.203: 70.57,69.76 71.32,69.76 U$7.3.3V@CAN1 71.67,67.41 v71.38,67.12 | v85.2,63.26 84.03,63.26 U$7.3.3V@CAN2 | U$7.3.3V@MSP1 83.44,50.05 80.53,50.05 79.92,49.44 79.92,49.23 78.7,48.02 71.38,48.02 69.22,50.18 U$7.3.3V_ANALOG@MSP2 66.57,38.37 U$7.3.3V@MSP2 66.45,38.25 65.25,38.25 65.25,32.75 65.45,32.55 C19.1 C20.1 | 67,50 65,50 65,70 65.25,70.25 67,70.25 | U$15.VDD 73.57,9.38 73.47,9.27 73.47,8.95 73.87,8.54 v73.87,8.44 | v71.54,11.59 71.94,11.49 72.45,11.49 U$15.VDDIO | v73.87,8.44 73.97,8.14 C21.1 72.87,7.6 | 73.76,7.72 72.87,7.6 | U$15.I2C/!SPI 76,10.47 76,8.97 75.47,8.44 74.5,8.44 | 74.5,8.44 v73.87,8.44 | U$15.!SPI_CS 74.5,8.44 | 72.87,7.6 67.61,7.6 67.32,7.88 67.32,25.41 72.15,30.24 72.15,32.52 v71.13,32.78 69.08,32.52 69.03,32.52 C20.1 | 69.15,32.75 C20.1
  Top 0.254: v82.31,34.05 81.97,34.39 81.65,34.39 80.72,35.32 R7.2 | C47.2 77.73,67.57 v77.23,67.07 | 67,70.25 70.08,70.25 70.57,69.76 | U$7.3.3V_ANALOG@MSP2 66.82,50.18 67,50 | R3.2 v79.51,32.78
  Top 0.61: U5.P$5 C45.1 C47.2
  Route3 0.203: v71.38,67.12 75.65,67.12 76.34,66.43 78.5,64.27 85,64.27 v85.2,63.26 | v71.54,11.59 71.54,8.54 72.96,8.54 73.06,8.44 v73.87,8.44
  Route3 0.254: v77.23,67.07 76.97,67.07 76.34,66.43
  Bottom 0.203: v82.31,34.05 80.27,32.01 79.51,32.01 72.65,32.01 72.15,32.52 v71.13,32.78
  Bottom 0.254: v79.51,32.78 79.51,32.01
BDOT_5V  (via drill 0.35)
  Top 0.254: 82.81,69.35 82.81,68.89 U$7.5V
  Top 0.61: C57.2 C55.1 U8.P$5 82.56,78.32 v82.56,79.51 | v82.56,70.37 82.81,70.11 82.81,69.35
  Route3 0.61: v82.56,79.51 v82.56,70.37
BDOT_DRDY
  Top 0.203: U$15.DRDY arc-90 72.42,10.42 70.37,10.42 69.1,11.69 69.1,15.25
  Top 0.254: J1.6 71.62,24.39 72.89,25.66 76.48,25.66 77.23,24.92 77.23,23.38 69.1,15.25
BDOT_DRDY_JP  (via drill 0.35)
  Top 0.254: J1.5 74.94,31 v74.94,36.84 | v74.94,40.9 78.06,44.03 U$7.P1.7_GPIO/PWM
  Route3 0.254: v74.94,36.84 v74.94,40.9
BDOT_GND  (via drill 0.35, 0.6)
  Top 0.203: C19.2 C20.2 69,34.5 v67.75,34.75 | U$15.GND 73.47,12.03 73.47,12.61 73.16,12.91 v73.16,13.22 | U$15.SOC 74.79,12.49 v74.79,13.22 | C17.2 v70.72,14.64 | C13.2 68.55,74.2 v69.45,74.2 v69.45,74.94
  Top 0.254: v74.36,4.84 74.36,5.36 74.02,5.7 | 74.02,5.7 C21.2 | v73.62,4.84 74.02,5.24 74.02,5.7
  Top 0.305: v78.08,74.27 77.95,73.5 77.89,73.45 | 77.89,73.45 C47.1 | v77.44,74.27 77.89,73.69 77.89,73.45 | v87.36,70.59 87.48,71.36 C46.1 88.12,71.16 v87.99,70.59
  Top 0.508: R4.2 v87.64,60.34 | R8.2 v87.64,69.22
  Top 0.61: U5.P$2 v85.99,72.34 v85.99,72.97 | U8.P$2 v78.88,77.16 v78.88,76.53 | v86.53,75.28 86.81,75.57 C57.1 86.81,75.63 v87.16,75.28 | v79.54,82.59 79.54,81.9 C56.1 79.83,82.24 v80.17,82.59
  GND 0.203: 68,34.75 v67.75,34.75 | v74.79,13.22 74.89,13.62 | v73.16,13.22 73.36,13.22 | v70.72,14.64 70.01,15.81
  pour GND: 64,90 90,90 90,31.75 64,31.75
  pour GND (rank 2): 65.03,1.16 88.75,1.16 89,31 75.5,31 75.5,34 71.5,34 71.5,31 65,31 65.03,12.71 75.7,12.71 75.7,8.9 65.03,8.9
  pour GND (no thermals): 65.03,13.47 71.89,13.47 71.89,8.39 65.03,8.39
BDOT_LDO_3V3_BYP
  Top 0.61: U5.P$4 C45.2
BDOT_LDO_5V_BYP
  Top 0.61: U8.P$4 C55.2
BDOT_P3.4_GPIO_DEBUG  (via drill 0.35)
  Top 0.203: U$7.P3.4_GPIO_DEBUG 81.76,41.53 82.74,42.5 | 82.74,42.5 82.76,42.53 | 82.74,42.5 82.74,42.54 82.76,42.56 82.76,43.34 U$14.7 | D4.A v87.64,54.37
  Route3 0.203: v87.64,54.37 87.64,52.01 86.72,51.08 86.72,50.2 87.53,49.39 U$14.7
BDOT_P3.5_GPIO_DEBUG
  Top 0.203: U$7.P3.5_GPIO_DEBUG 81.65,42.03 82.36,42.73 82.36,45.22 U$14.8 86.63,51.79 86.63,60.52 87.64,61.52 D3.A
BDOT_RXD
  Top 0.203: U$14.4 87.74,40.53 U$7.P2.1_RXD
BDOT_SBWTCK
  Top 0.203: U$7.SBWTCK 77.8,37.54 78.29,37.04 83.35,37.04 U$14.SBWTCK
BDOT_SBWTDIO
  Top 0.203: U$7.SBWTDIO 78.3,37.65 78.5,37.45 83.52,37.45 85.56,35.4 U$14.2
BDOT_SCL
  Top 0.203: 72.96,9.41 U$15.SCL/SPI_SCK 72.19,8.65 69.86,8.65 68.08,10.42 68.08,16.01
  Top 0.254: 68.08,16.01 73.42,21.35 J1.4
BDOT_SCL_JP  (via drill 0.35)
  Top 0.254: J1.3 77.23,30.74 82.05,30.74 82.17,30.86 82.19,30.86 R3.1 81.75,33.21 81.67,33.21 80.49,34.39 79.85,34.39 77.91,36.33 v76.21,36.33 | v76.21,44.97 76.27,45.03 U$7.P5.1_I2C-SCL-1
  Route3 0.254: v76.21,36.33 v76.21,44.97
BDOT_SDA
  Top 0.203: 71.72,9.22 U$15.SDA/SPI_SDI 71.65,9.15 70.11,9.15 68.59,10.68 68.59,15.76
  Top 0.254: 68.59,15.76 75.96,23.12 J1.2
BDOT_SDA_JP  (via drill 0.35)
  Top 0.254: J1.1 79,29.98 82.81,29.98 83.83,31 83.83,35.32 R7.1 82.05,35.45 82.05,36.33 81.8,36.59 79.51,36.59 79.26,36.33 v79,36.33 | v77,44.18 77.35,44.53 U$7.P5.0_I2C-SDA-1
  Route3 0.254: v79,36.33 77,38.34 v77,44.18
BDOT_TXD
  Top 0.203: U$7.P2.0_TXD 82.68,38.68 83.41,37.94 U$14.3
BDOT_VBAT
  Top 0.254: U5.P$3 | C46.2 87.94,73.72 | U8.P$1 80.03,78.15 77.53,78.15 77.28,78.4 76.22,78.4 75.97,78.15 66.68,78.15 66.59,78.24 67.07,78.24 67.16,78.15 | U$6.P$86 67.33,79.42
  Top 0.508: U5.P$1 | 79.83,80.02 C56.2
  Top 0.61: 83.45,73.29 U5.P$3 | 83.45,73.29 83.45,71.38 U5.P$1 | U8.P$1 81.42,78.11 81.42,76.21 | 81.42,76.21 81.41,76.21 U8.P$3 | U8.P$1 79.83,78.35 79.83,80.02 | U5.P$3 84.85,73.33 84.85,74.18 86.12,74.18 86.82,73.48 C46.2 | 83.45,73.29 83.45,74.56 83.32,74.69 81.54,74.69 81.42,74.81 81.42,76.21
  Top 1.016: C13.1 66.62,76.85 U$6.P$85
  Top 1.524: U$6.P$86 66.59,78.24 U$6.P$85
CANH  (via drill 0.35)
  Top 0.254: R6.1 13.47,70.63 13.47,74.17 47.25,74.17 v47.76,74.69 | U$6.P$53 47.01,76.88 48.28,78.15 49.34,78.15 50.08,77.41 50.08,73.38 50.76,72.7 58.43,72.7 | 58.43,72.7 70.09,72.7 70.91,73.52 73.56,73.52 75.7,71.37 75.7,66.81 75.13,66.24 U$7.CANH | 58.43,72.7 v58.43,73.67 | v58.43,71.13 58.43,54.23 | 58.43,54.23 56.59,52.38 53.67,52.38 52.7,53.35 BLK1.CANH | 58.43,54.23 58.43,28.2 56.4,26.17 53.6,26.17 52.7,27.07 BLK2.CANH
  Bottom 0.254: v47.76,74.69 46.27,76.18 U$6.P$53 | v58.43,73.67 v58.43,71.13
CANL  (via drill 0.35)
  Top 0.254: U$7.CANL 75.02,66.89 75.25,67.12 75.25,71.18 73.36,73.06 71.09,73.06 70.28,72.25 57.41,72.25 | 57.41,72.25 49.63,72.25 48.82,73.06 U$6.P$57 46.56,74.63 R5.1 | 57.41,72.25 57.41,53.86 | 57.41,53.86 56.4,52.84 53.86,52.84 53.35,53.35 BLK1.CANL | 57.41,53.86 57.16,53.86 v56.65,54.37 | v56.65,51.06 56.65,27.19 56.14,26.68 53.74,26.68 53.35,27.07 BLK2.CANL
  Bottom 0.254: v56.65,54.37 v56.65,51.06
ESTIMAT_3V3  (via drill 0.35)  (9 unrouted)
  Top 0.254: BLK1.3.3V@CAN2 48.78,45.06 48.78,49.29
  Top 0.508: C44.2 C32.1 U4.P$5 7.42,75.22 7.61,75.03 7.61,68.83 v7.38,68.59 | v24.65,63.76 24.65,61.76 BLK1.3.3V@MSP2 25.82,61.63 26.17,61.99 35.06,61.99 35.57,61.48 36.55,61.48 BLK1.3.3V_ANALOG@MSP2 | v36.59,42.68 36.59,44.55 BLK1.3.3V@MSP1 | v36.59,42.68 49.29,42.68 | 49.29,42.68 49.62,43.02 BLK1.3.3V@CAN2 | BLK1.3.3V@CAN1 52.35,56.65 v51.06,56.65 | v53.35,51.06 50.56,51.06 48.78,49.29 | v36.59,42.68 36.59,37.86 | 36.59,37.86 36.59,35.73 BLK2.3.3V_ANALOG@MSP2 | 36.59,37.86 25.66,37.86 24.78,36.97 BLK2.3.3V@MSP2 | 49.29,42.68 51.06,40.9 v51.06,35.57 | v51.32,30.74 51.74,31.16 BLK2.3.3V@CAN1 | BLK2.3.3V@CAN2 49.54,18.23 49.54,16.01 v47.51,16.01 37.35,16.01 36.63,16.73 BLK2.3.3V@MSP1
  Route3 0.508: v7.38,68.59 12.2,63.76 v24.65,63.76 26.8,61.61 27.16,61.61 33.79,54.98 33.79,43.19 36.08,43.19 v36.59,42.68 | v51.06,56.65 51.06,54.87 53.35,52.59 v53.35,51.06 | v51.06,35.57 51.32,35.32 v51.32,30.74 47.51,26.93 v47.51,16.01
  other vias: 7.63,69.1 24.14,63.76 51.57,56.65 52.84,51.06 51.06,36.08 51.32,31.25 47,16.01 48.02,16.01 36.59,42.17
ESTIMAT_5V  (via drill 0.35)  (3 unrouted)
  Top 0.508: v4.84,70.11 4.79,70.07 U6.P$5 C48.1 C51.2 | v55.44,46.75 55.44,45.64 BLK1.5V | v56.65,20.84 56.14,20.33 55.64,20.33 55.24,19.94 BLK2.5V
  Route3 0.508: v4.84,70.11 32.27,70.11 40.23,62.15 40.23,61.17 43.07,58.33 44.05,58.33 55.44,46.95 v55.44,46.75 57.41,44.77 57.41,21.6 v56.65,20.84
  other vias: 4.84,69.61 57.16,21.35 55.44,47.25
ESTIMAT_GND  (via drill 0.35, 0.6)
  Top 0.203: C16.2 11.02,72.15 v11.85,72.15
  Top 0.254: 22.75,44.6 22.75,45.34 | 22.75,44.58 22.75,44.6 | 22.75,44.6 v23.12,44.97 22.75,45.34 | R1.2 22.75,44.58 | 22.75,44.58 v22.36,44.97 22.75,45.36 | 22.75,45.36 R2.2 | 22.75,45.34 22.75,45.36 | R9.2 22.5,18.16 | 22.5,18.16 v22.11,18.55 22.5,18.94 | 22.5,18.16 22.5,18.18 | 22.5,18.18 v22.87,18.55 22.5,18.92 | 22.5,18.18 22.5,18.92 | R10.2 22.5,18.94 | 22.5,18.94 22.5,18.92
  Top 0.305: v3.4,79.35 3.28,78.59 3.22,78.53 | 3.22,78.53 C44.1 | v2.77,79.35 3.22,78.77 3.22,78.53 | v10.71,82.84 10.58,82.08 C36.1 9.94,82.28 v10.07,82.84
  Top 0.508: v10.07,82.84 10.37,83.14 C2.2 10.37,83.17 v10.71,82.84
  Top 0.61: U4.P$2 v11.31,77.42 v11.31,78.05 | U6.P$2 v4.9,66.18 v5.53,66.18 | v6.78,73.83 6.49,74.11 C51.1 6.43,74.11 v6.78,74.46 | v1.56,69.89 1.56,69.19 C49.1 1.85,69.54 v2.2,69.89
  GND 0.203: v11.85,72.15 12.25,71.74
  pour GND: -0.71,92.66 63.06,92.56 63.01,71 63,33 63,-0.5 -2.25,-0.75
ESTIMAT_LDO_3V3_BYP
  Top 0.61: U4.P$4 C32.2
ESTIMAT_LDO_5V_BYP
  Top 0.61: U6.P$4 C48.2
ESTIMAT_VBAT
  Top 0.254: U4.P$3 | 10.12,79.72 C36.2 11.38,79.96 11.69,80.27 11.69,81.04 | U6.P$1 | U$6.P$78 60.24,80.69 14.03,80.69 13.78,80.94 11.79,80.94 11.69,81.04 | C2.1 10.37,85.69 11.69,84.37 11.69,81.04
  Top 0.508: U4.P$1 | C49.2 1.85,67.32 | 1.66,67.19 C49.2 | 8.77,78.37 8.77,79.89 8.39,80.27 1.79,80.27 1.53,80.02 1.53,71.38 2.55,71.38 2.8,71.13 2.8,70.72 3.06,70.47 3.06,68.84 3.19,68.72 3.95,68.72 | U6.P$1 3.9,67.32 2.42,67.32 C49.2
  Top 0.61: U4.P$3 8.77,78.37 8.77,76.46 U4.P$1 | 10.12,79.72 U4.P$3 | U6.P$1 3.95,68.72 5.85,68.72 U6.P$3
  Top 1.524: U$6.P$78 U$6.P$77
N$1
  Top 0.254: D2.C R1.1
N$2
  Top 0.254: D1.C R2.1
N$3
  Top 0.254: D6.C R9.1
N$4
  Top 0.254: D5.C R10.1
N$16
  Top 0.508: D4.C R4.1
N$17
  Top 0.203: 9.03,71.64 C16.1 9.1,72.03
  Top 0.254: 9.03,74.56 R5.2 9.1,72.15 | 9.1,72.15 9.1,71.7 9.03,71.64 | R6.2 9.32,71.93 9.1,72.15
N$18
  Top 0.508: D3.C R8.1
N$19
  Top 0.203: U$15.C1 73.97,12.02 73.97,13.83 73.45,14.52 C17.1
N$20
  Top 0.203: U$15.SETP 76.34,12.79 C18.2
N$21
  Top 0.203: U$15.SETC 72.25,12.74 72.25,13.52 72.25,13.47 72.36,13.59 72.38,13.59 72.55,13.76 72.55,15.55 72.65,15.66 75.8,15.66 76.54,14.92 C18.1
P3.4_GPIO_DEBUG  (1 unrouted)
  Top 0.254: U$1.7 15.87,46.24 17.6,47.97 23.57,47.97 24.22,47.31 24.22,46.24 27.7,46.24 27.99,46.54 BLK1.P3.4_GPIO_DEBUG
P3.4_GPIO_DEBUG1  (1 unrouted)
  Top 0.254: U$2.7 15.87,19.82 17.36,21.31 24.57,21.31 25.85,20.02 27.7,20.02 27.99,20.32 BLK2.P3.4_GPIO_DEBUG
P3.5_GPIO_DEBUG  (1 unrouted)
  Top 0.254: U$1.8 16.52,43.7 17.28,44.46 17.28,47 17.79,47.51 23.38,47.51 23.76,47.12 23.76,46.05 24.03,45.78 27.89,45.78 28.49,46.39 BLK1.P3.5_GPIO_DEBUG
P3.5_GPIO_DEBUG1
  Top 0.254: U$2.8 D6.A 17.28,18.78 17.28,20.58 17.55,20.85 19.52,20.85 19.53,20.84 24.39,20.84 25.66,19.57 28.2,19.57 28.49,19.86 BLK2.P3.5_GPIO_DEBUG
RXD
  Top 0.254: BLK1.P2.1_RXD 26.07,48.42 14.84,48.42 9.41,53.86 U$1.4
RXD1
  Top 0.254: BLK2.P2.1_RXD 26.6,21.98 7.63,21.98 U$2.4
SBWTCK
  Top 0.254: BLK1.SBWTCK 20.79,50.35 9.66,61.48 U$1.SBWTCK
SBWTCK1
  Top 0.254: U$2.SBWTCK 13.05,24.44 BLK2.SBWTCK
SBWTDIO
  Top 0.254: BLK1.SBWTDIO 18.5,49.85 9.41,58.94 U$1.2
SBWTDIO1
  Top 0.254: BLK2.SBWTDIO 10.75,23.94 U$2.2
TXD
  Top 0.254: BLK1.P2.0_TXD 16.46,49.35 9.41,56.4 U$1.3
TXD1
  Top 0.254: U$2.3 8.97,23.44 BLK2.P2.0_TXD

### Text on the board
Reference: COMPUTER GND | BDOT GND | COMPUTER VBAT | BDOT VBAT | CANL | CANH | P3.5 GPIO | P3.4 GPIO | BDOT GND | BDOT GND | RXD | TXD | SBWTDIO | SBWTCK
tDocu: SBWTCK | SBWTDIO | TXD | RXD | GND | GND | P3.4_GPIO | P3.5_GPIO | SBWTCK | SBWTDIO | TXD | RXD | GND | GND | P3.4_GPIO | P3.5_GPIO
tSilk: ENV_ESTIM | FSW | DRDY | SCL | SDA